# EAGLE design Skaarhoj BI8-1x8v1.1 (EAGLE 6.1)
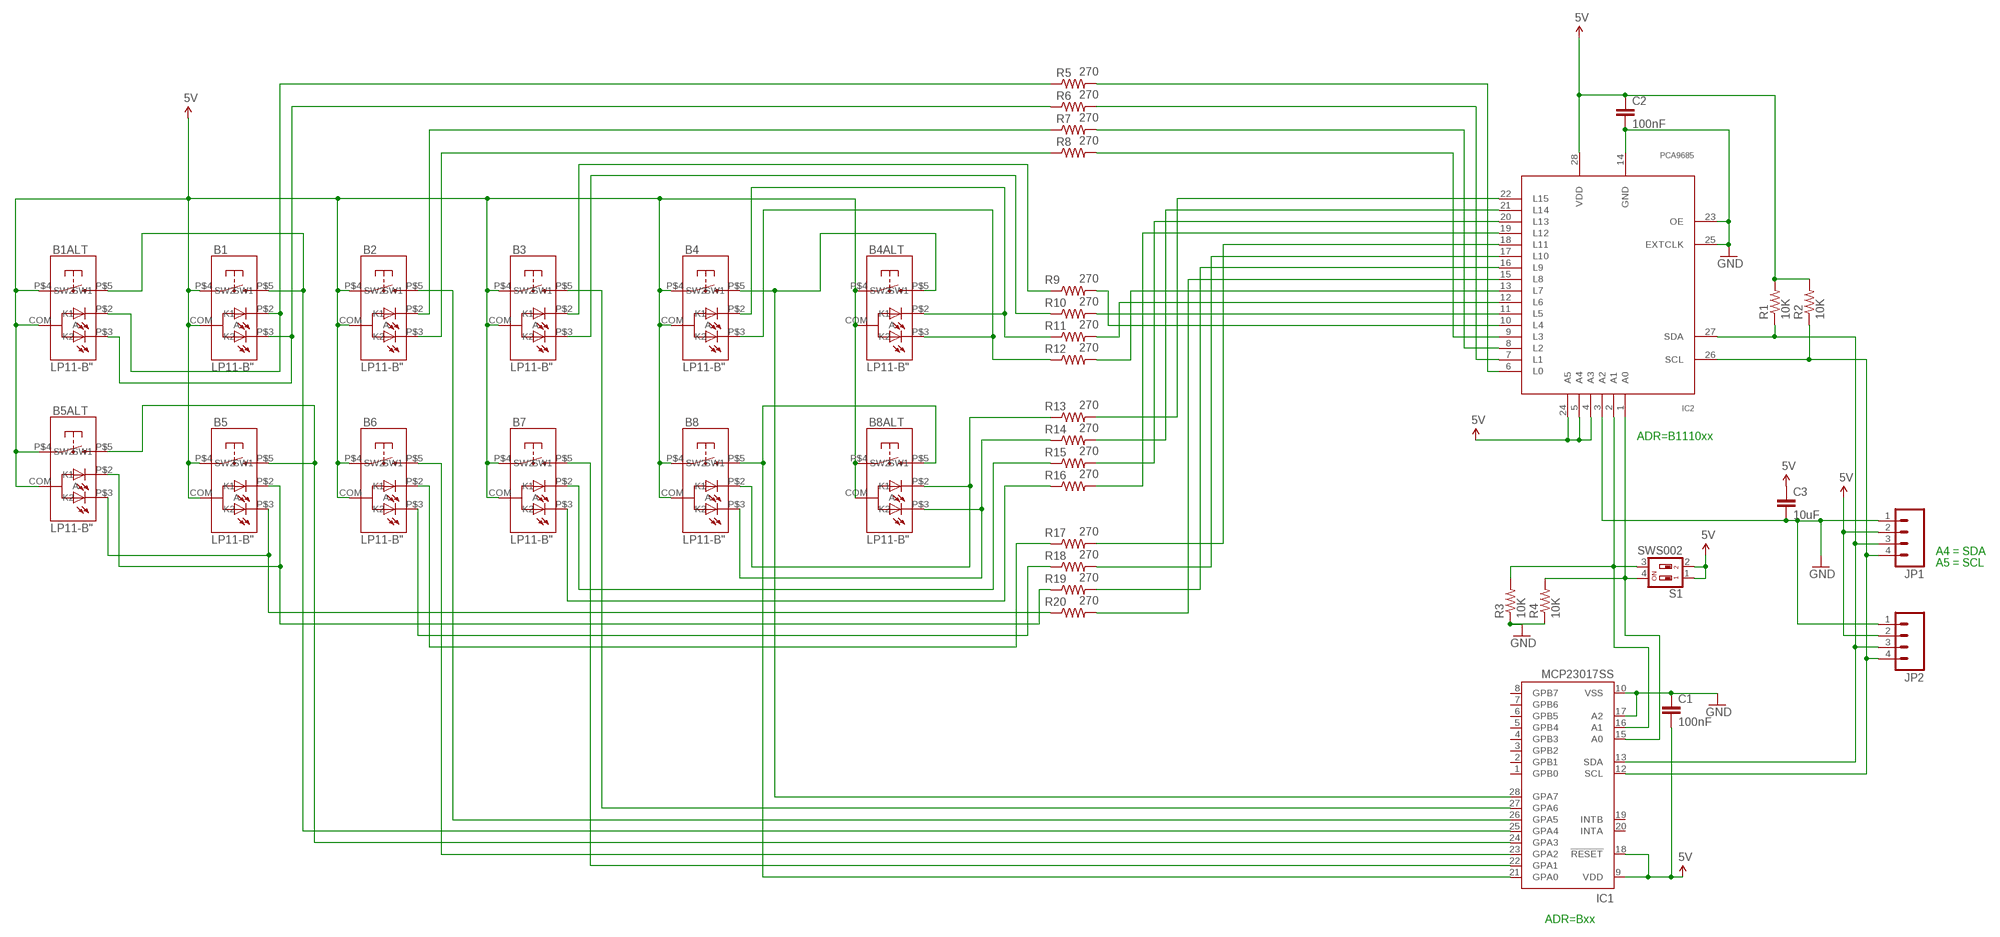
[diagram p0: schematic, sheet 1]

## Parts
B1  LP11-B"  [LP11]
B1ALT  LP11-B"  [LP11]
B2  LP11-B"  [LP11]
B3  LP11-B"  [LP11]
B4  LP11-B"  [LP11]
B4ALT  LP11-B"  [LP11]
B5  LP11-B"  [LP11]
B5ALT  LP11-B"  [LP11]
B6  LP11-B"  [LP11]
B7  LP11-B"  [LP11]
B8  LP11-B"  [LP11]
B8ALT  LP11-B"  [LP11]
C1  100nF  CAP0603-CAP  [0603-CAP]
C2  100nF  CAP0603-CAP  [0603-CAP]
C3  10uF  CAP0805  [0805]
IC1  MCP23017SS  [SSOP28]
IC2  PCA9685  [TSSOP28]
JP1  M04PTH  [1X04]
JP2  M04PTH  [1X04]
R1  10K  RESISTOR0603-RES  [0603-RES]
R2  10K  RESISTOR0603-RES  [0603-RES]
R3  10K  RESISTOR0603-RES  [0603-RES]
R4  10K  RESISTOR0603-RES  [0603-RES]
R5  270  RESISTOR0603-RES  [0603-RES]
R6  270  RESISTOR0603-RES  [0603-RES]
R7  270  RESISTOR0603-RES  [0603-RES]
R8  270  RESISTOR0603-RES  [0603-RES]
R9  270  RESISTOR0603-RES  [0603-RES]
R10  270  RESISTOR0603-RES  [0603-RES]
R11  270  RESISTOR0603-RES  [0603-RES]
R12  270  RESISTOR0603-RES  [0603-RES]
R13  270  RESISTOR0603-RES  [0603-RES]
R14  270  RESISTOR0603-RES  [0603-RES]
R15  270  RESISTOR0603-RES  [0603-RES]
R16  270  RESISTOR0603-RES  [0603-RES]
R17  270  RESISTOR0603-RES  [0603-RES]
R18  270  RESISTOR0603-RES  [0603-RES]
R19  270  RESISTOR0603-RES  [0603-RES]
R20  270  RESISTOR0603-RES  [0603-RES]
S1  SWS002  [SMS-002]

## Nets
5V [Power]: B1.COM(A) B1.P$4(SW1) B1ALT.COM(A) B1ALT.P$4(SW1) B2.COM(A) B2.P$4(SW1) B3.COM(A) B3.P$4(SW1) B4.COM(A) B4.P$4(SW1) B4ALT.COM(A) B4ALT.P$4(SW1) B5.COM(A) B5.P$4(SW1) B5ALT.COM(A) B5ALT.P$4(SW1) B6.COM(A) B6.P$4(SW1) B7.COM(A) B7.P$4(SW1) B8.COM(A) B8.P$4(SW1) B8ALT.COM(A) B8ALT.P$4(SW1) C1.2 C2.1 C3.1 IC1.9(VDD) IC1.18(!RESET) IC2.4(A3) IC2.5(A4) IC2.24(A5) IC2.28(VDD) JP1.2 JP2.2 R1.2 R2.2 S1.1 S1.2
GND [Power]: C1.1 C2.2 C3.2 IC1.10(VSS) IC1.17(A2) IC2.3(A2) IC2.14(GND) IC2.23(OE) IC2.25(EXTCLK) JP1.1 JP2.1 R3.1 R4.1
N$1: IC1.15(A0) IC2.1(A0) R4.2 S1.4
N$3: IC1.13(SDA) IC2.27(SDA) JP1.3 JP2.3 R1.1
N$4: B2.P$2(K1) R7.1
N$5: B2.P$3(K2) R8.1
N$6: IC1.12(SCL) IC2.26(SCL) JP1.4 JP2.4 R2.1
N$7: B1.P$2(K1) B1ALT.P$2(K1) R5.1
N$8: B1.P$3(K2) B1ALT.P$3(K2) R6.1
N$9: IC2.6(L0) R5.2
N$10: IC2.7(L1) R6.2
N$11: IC2.8(L2) R7.2
N$12: IC2.9(L3) R8.2
N$13: IC2.10(L4) R9.2
N$14: IC2.11(L5) R10.2
N$15: IC2.12(L6) R11.2
N$16: IC2.13(L7) R12.2
N$17: B3.P$2(K1) R9.1
N$18: B3.P$3(K2) R10.1
N$19: B4.P$2(K1) B4ALT.P$2(K1) R11.1
N$20: B4.P$3(K2) B4ALT.P$3(K2) R12.1
N$21: IC2.19(L12) R16.2
N$22: IC2.20(L13) R15.2
N$23: IC2.21(L14) R14.2
N$24: IC2.22(L15) R13.2
N$25: IC2.15(L8) R20.2
N$26: IC2.16(L9) R19.2
N$27: IC2.17(L10) R18.2
N$28: IC2.18(L11) R17.2
N$29: B5.P$3(K2) B5ALT.P$3(K2) R20.1
N$30: B5.P$2(K1) B5ALT.P$2(K1) R19.1
N$31: B6.P$3(K2) R18.1
N$32: B6.P$2(K1) R17.1
N$33: B7.P$3(K2) R16.1
N$34: B7.P$2(K1) R15.1
N$35: B8.P$3(K2) B8ALT.P$3(K2) R14.1
N$36: B8.P$2(K1) B8ALT.P$2(K1) R13.1
N$37: B1.P$5(SW2) B1ALT.P$5(SW2) IC1.25(GPA4)
N$38: B5.P$5(SW2) B5ALT.P$5(SW2) IC1.24(GPA3)
N$39: B6.P$5(SW2) IC1.23(GPA2)
N$40: B2.P$5(SW2) IC1.26(GPA5)
N$41: B8.P$5(SW2) B8ALT.P$5(SW2) IC1.21(GPA0)
N$42: B7.P$5(SW2) IC1.22(GPA1)
N$43: B4.P$5(SW2) B4ALT.P$5(SW2) IC1.28(GPA7)
N$44: B3.P$5(SW2) IC1.27(GPA6)
N$47: IC1.16(A1) IC2.2(A1) R3.2 S1.3
Unconnected: IC1.1(GPB0) IC1.2(GPB1) IC1.3(GPB2) IC1.4(GPB3) IC1.5(GPB4) IC1.6(GPB5) IC1.7(GPB6) IC1.8(GPB7) IC1.19(INTB) IC1.20(INTA)

## Notes on the sheet
- ADR=B1110xx
- A4 = SDA
- A5 = SCL
- ADR=Bxx

## Library data of the parts
B1 B1ALT B2-B4 B4ALT B5 B5ALT B6-B8 B8ALT = SKAARHOJ:LP11-B
C1-C3 = SparkFun:CAP: Capacitor Standard 0603 ceramic capacitor, and 0.1" leaded capacitor.
IC1 = microchip:MCP23017: http://ww1.microchip.com/downloads/en/DeviceDoc/21952a.pdf Source: http://ww1.microchip.com/downloads/en/DeviceDoc/21952a.pdf; MF: MICROCHIP; MPN: MCP23017-E/SS; OC_FARNELL: 1467674; OC_NEWARK: 31K2960
IC2 = wsmith:PCA9685
JP1 JP2 = SparkFun:M04: Header 4 Standard 4-pin 0.1" header. Use with straight break away headers (SKU : PRT-00116), right angle break away headers (PRT-00553), swiss pins (PRT-00743), machine pins (PRT-00117), and female headers (PRT-00115). Molex polarized connector foot print use with SKU : PRT-08231 with associated crimp pins and housings. 1MM SMD Version SKU: PRT-10208
R1-R20 = SparkFun:RESISTOR: Resistor Basic schematic elements and footprints for 0603, 1206, and PTH resistors.
S1 = smd-special:SWS002: SMD Dip Switch 2 pol.

## Board
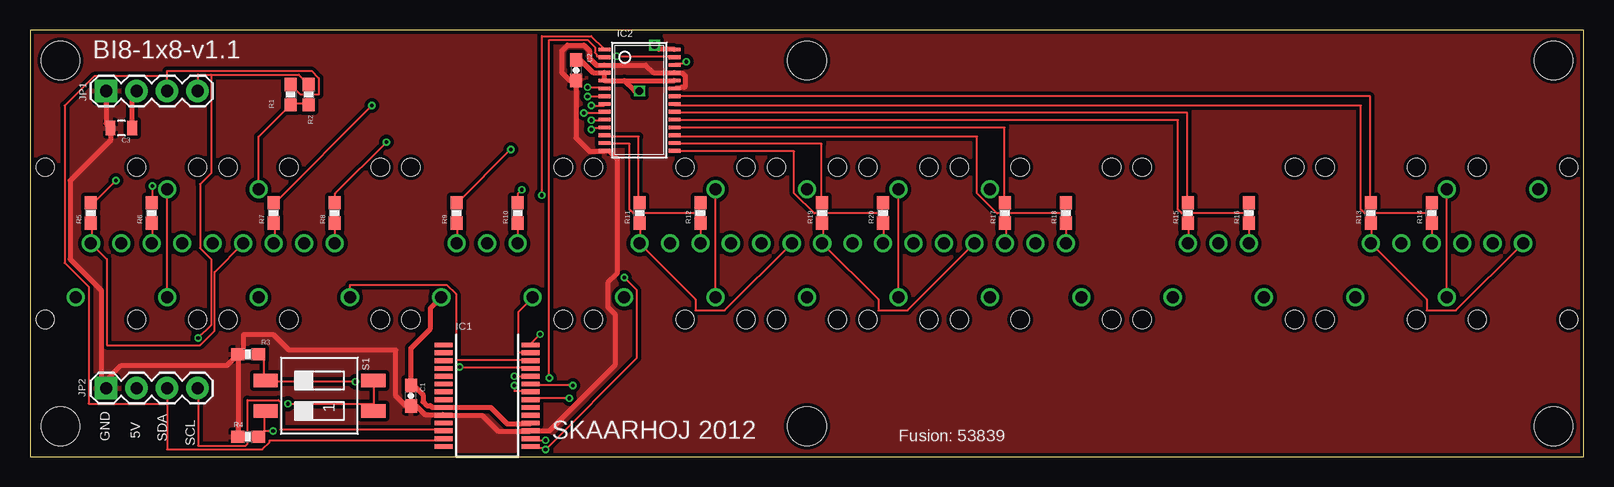
[diagram p1: board, top side]
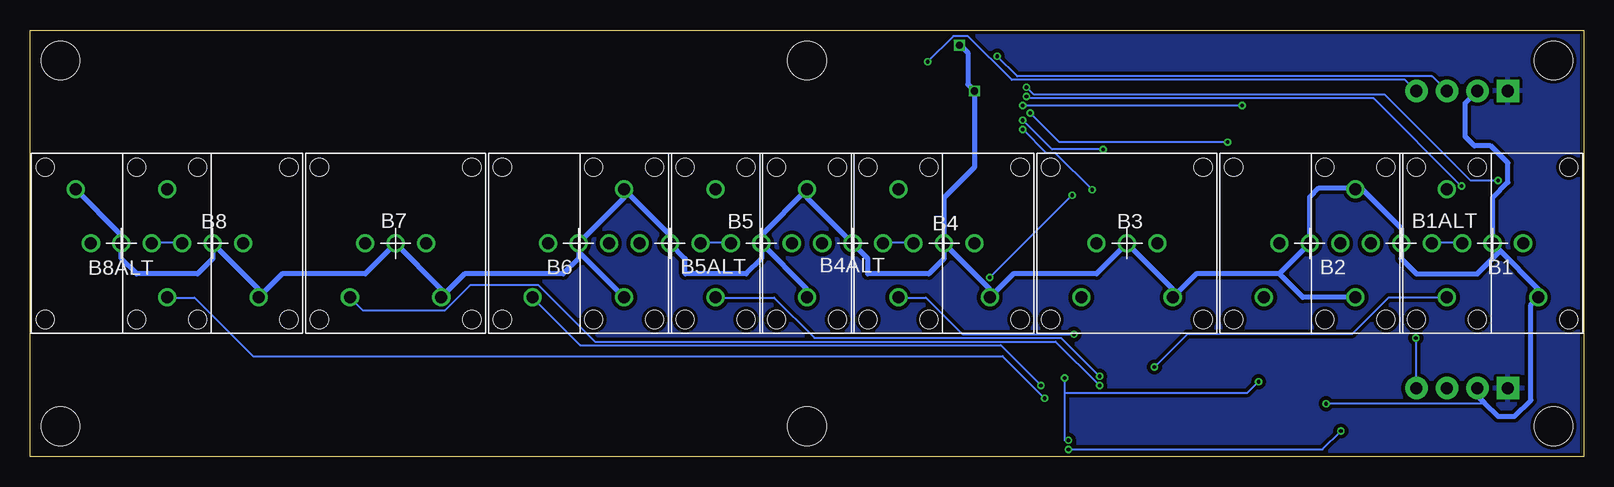
[diagram p2: board, bottom side, seen from below]

Size 129.54 x 35.56 mm. Coordinates in mm from the lower left corner, seen from the top.
Outline: 0,0 129.54,0 129.54,35.56 0,35.56 0,0
Copper layers (1*16): Top 0.035mm / dielectric 1.5mm / Bottom 0.035mm
Design rules: minimum track width 6mil, minimum drill 12mil, track to track 6mil, track to pad 6mil, pad to pad 6mil, via to via 6mil, smd to smd 0mil, copper to edge 10mil, drill to drill 10mil, minimum pad ring 10mil, minimum via ring 6mil, stop-mask expansion 2mil, vias tented up to drill 100mil, thermal gap 10mil
Holes 3.2 mm at 2.54,33.02 2.54,2.54 127,2.54 127,33.02 64.77,33.02 64.77,2.54

### Footprints (pad centres in the part's own frame; a part is rotated, then mirrored left to right if it is on the bottom)
LP11 = drill 1: COM 0,0; P$2 0,2.54; P$3 0,-2.54; P$4 4.5,3.81; P$5 4.5,-3.81 | hole 1.5: -6.35,6.35; 6.35,6.35; 6.35,-6.35; -6.35,-6.35
0603-CAP = smd 1.1 x 1: 1 -0.85,0; 2 0.85,0
0805 = smd 0.8 x 1.2: 1 -0.9,0; 2 0.9,0
SSOP28 = smd 0.4 x 1.5: 1 -4.225,-3.625; 2 -3.575,-3.625; 3 -2.925,-3.625; 4 -2.275,-3.625; 5 -1.625,-3.625; 6 -0.975,-3.625; 7 -0.325,-3.625; 8 0.325,-3.625; 9 0.975,-3.625; 10 1.625,-3.625; 11 2.275,-3.625; 12 2.925,-3.625; 13 3.575,-3.625; 14 4.225,-3.625; 15 4.225,3.625; 16 3.575,3.625; 17 2.925,3.625; 18 2.275,3.625; 19 1.625,3.625; 20 0.975,3.625; 21 0.325,3.625; 22 -0.325,3.625; 23 -0.975,3.625; 24 -1.625,3.625; 25 -2.275,3.625; 26 -2.925,3.625; 27 -3.575,3.625; 28 -4.225,3.625
TSSOP28 = smd 0.305 x 0.991: 1 -4.225,-2.918; 2 -3.575,-2.918; 3 -2.925,-2.918; 4 -2.275,-2.918; 5 -1.625,-2.918; 6 -0.975,-2.918; 7 -0.325,-2.918; 8 0.325,-2.918; 9 0.975,-2.918; 10 1.625,-2.918; 11 2.275,-2.918; 12 2.925,-2.918; 13 3.575,-2.918; 14 4.225,-2.918; 15 4.225,2.918; 16 3.575,2.918; 17 2.925,2.918; 18 2.275,2.918; 19 1.625,2.918; 20 0.975,2.918; 21 0.325,2.918; 22 -0.325,2.918; 23 -0.975,2.918; 24 -1.625,2.918; 25 -2.275,2.918; 26 -2.925,2.918; 27 -3.575,2.918; 28 -4.225,2.918
1X04 = drill 1.016 pad 1.88 square: 1 0,0 | drill 1.016 pad 1.88: 2 2.54,0; 3 5.08,0; 4 7.62,0
0603-RES = smd 1.1 x 1: 1 -0.85,0; 2 0.85,0
SMS-002 = smd 1.092 x 2.007: 1 -1.27,-4.496; 2 1.27,-4.496; 3 1.27,4.496; 4 -1.27,4.496

### Placement (x,y rotation side)
B1  7.62,17.78 270 bottom
B1ALT  15.24,17.78 90 bottom
B2  22.86,17.78 270 bottom
B3  38.1,17.78 270 bottom
B4  53.34,17.78 270 bottom
B4ALT  60.96,17.78 90 bottom
B5  68.58,17.78 270 bottom
B5ALT  76.2,17.78 90 bottom
B6  83.82,17.78 270 bottom
B7  99.06,17.78 270 bottom
B8  114.3,17.78 270 bottom
B8ALT  121.92,17.78 90 bottom
C1  31.75,5.08 90 top
C2  45.52,32.21 270 top
C3  7.62,27.38 180 top
IC1  38.1,5.08 270 top
IC2  50.8,29.72 270 top
JP1  6.35,30.48 0 top
JP2  6.35,5.71 0 top
R1  21.74,30.18 270 top
R2  23.22,30.18 270 top
R3  18.19,8.53 0 top
R4  18.19,1.68 0 top
R5  5.08,20.32 90 top
R6  10.16,20.32 90 top
R7  20.32,20.32 90 top
R8  25.4,20.32 90 top
R9  35.56,20.32 90 top
R10  40.64,20.32 90 top
R11  50.8,20.32 90 top
R12  55.88,20.32 90 top
R13  111.76,20.32 90 top
R14  116.84,20.32 90 top
R15  96.52,20.32 90 top
R16  101.6,20.32 90 top
R17  81.28,20.32 90 top
R18  86.36,20.32 90 top
R19  66.04,20.32 90 top
R20  71.12,20.32 90 top
S1  24.13,5.08 90 top

### Tracks (layer width: path | path; a pad name or v marks a point on that pad's centre or on a via)
5V  (via drill 0.3, 0.6)
  Top 0.152: 28.65,4.42 28.65,6.25 S1.2 | 28.65,4.42 28.65,3.81 S1.1 | R2.2 23.16,29.41 21.79,29.41 R1.2 21.64,29.26 19.05,26.67 B1ALT.P$4 | v21.49,4.42 28.65,4.42
  Top 0.406: C3.1 8.52,30.11 JP1.2 | C2.1 45.89,33.06 46.94,32 47.87,32 IC2.4 IC2.5 49.53,31.34 | 49.53,31.34 IC2.24 | IC1.18 41.66,2.74 39.78,2.74 38.41,4.11 IC1.9 34.47,4.12 33.53,4.12 33.38,4.27 33.07,4.27 32.77,4.57 32.77,5.18 32.02,5.93 C1.2 31.75,9.04 33.38,10.67 33.38,12.37 B3.P$4 | IC2.28 52.42,33.94 v52.07,34.29 | v50.8,30.48 50.39,30.48 49.53,31.34
  Bottom 0.152: v21.49,4.42 8.38,4.42 8.31,4.5
  Bottom 0.406: JP2.2 8.89,5.08 8.31,4.5 7.16,3.35 5.79,3.35 4.42,4.72 4.42,12.67 B1.P$4 3.81,13.97 6.99,17.14 | 6.99,17.14 B1.COM 7.62,21.59 6.35,22.86 6.35,24.49 7.77,25.91 9.14,25.91 9.91,26.67 9.91,29.46 JP1.2 | v52.07,34.29 51.97,34.29 51.36,33.68 51.36,31.04 v50.8,30.48 50.8,24.13 53.34,21.59 B4.COM | B4.COM 49.53,13.97 B4.P$4 47.57,15.24 40.64,15.24 B3.COM 34.29,13.97 B3.P$4 32.33,15.24 25.4,15.24 | B5.P$4 64.77,13.97 B5.COM | B5.COM 68.58,18.47 B4ALT.P$4 64.77,21.59 B4ALT.COM 59.69,16.51 59.69,15.24 54.61,15.24 53.34,16.51 B4.COM | B6.COM 80.01,21.59 B5ALT.P$4 76.2,18.47 B5ALT.COM 74.93,16.51 74.93,15.24 69.85,15.24 68.58,16.51 B5.COM | B6.COM 83.82,17.09 B6.P$4 | B6.COM 83.82,16.51 85.09,15.24 93.29,15.24 B7.P$4 95.25,13.97 B7.COM 101.6,15.24 108.53,15.24 B8.P$4 110.49,13.97 B8.COM 114.3,16.51 115.57,15.24 120.65,15.24 121.92,16.51 B8ALT.COM 121.92,18.47 B8ALT.P$4 | B2.P$4 23.44,13.28 25.4,15.24 | 25.4,15.24 B2.COM 22.86,21.64 22.1,22.4 19.17,22.4 B1ALT.P$4 18.47,22.28 15.24,19.05 B1ALT.COM 15.24,16.51 13.97,15.24 8.89,15.24 6.99,17.14
GND
  Top 0.254: 54.25,30.79 53.81,30.79 IC2.23
  Top 0.406: JP1.1 6.35,27.75 C3.2 6.72,26.38 3.35,23.01 3.35,16.46 5.94,13.87 5.94,6.12 JP2.1 6.35,6.35 7.62,7.62 16.42,7.62 R3.1 | R3.1 R4.1 | R3.1 17.78,8.98 17.78,10.16 20.32,10.16 21.59,8.89 30.48,8.89 30.48,5.08 31.33,4.23 C1.1 32.19,4.23 32.92,3.5 34.42,3.5 IC1.10 37.69,3.46 39.01,2.13 41.7,2.13 IC1.17 41.75,2.13 43.28,2.13 48.77,7.62 48.77,11.89 48.16,12.5 48.16,14.48 48.92,15.24 48.92,24.84 48.27,25.49 IC2.14 47.84,25.45 46.63,25.45 45.52,26.57 C2.2 44.99,31.36 44.35,32 44.35,33.83 44.81,34.29 46.18,34.29 46.63,33.83 46.63,33.22 47.24,32.61 47.85,32.61 IC2.3 51.33,32.64 51.97,32 53.71,32 IC2.25 54.37,31.99 54.61,31.75 54.61,30.84 54.56,30.79 54.25,30.79
  pour Bottom (isolate 0.305): 0,35.56 129.54,35.56 129.54,0 0,0
  pour Top (isolate 0.305): 0,35.56 129.54,35.56 129.54,0 0,0
N$1  (via drill 0.3)
  Top 0.152: 19.51,2.13 R4.2 19.51,2.13 | 19.51,2.13 19.51,3.81 S1.4 | v42.67,21.79 42.67,35.05 46.79,35.05 47.85,33.98 IC2.1 | v49.53,14.94 50.6,13.87 50.6,8.23 43.13,0.76 42.98,0.76 | 42.98,0.76 41.76,0.76 IC1.15 | v20.27,2.13 19.51,2.13 | 42.98,0.76 v42.98,0.61
  Bottom 0.152: v49.53,14.94 v42.67,21.79 | v20.27,2.13 21.79,0.61 v42.98,0.61
N$3  (via drill 0.3)
  Top 0.152: JP2.3 11.43,4.42 | 11.43,4.42 11.43,0.61 19.36,0.61 19.96,1.22 19.96,1.37 34.44,1.37 IC1.13 | v48.92,33.38 53.65,33.38 IC2.27 | JP1.3 11.43,31.7 | 11.43,31.7 11.43,32.16 23.47,32.16 24.08,31.55 24.08,30.18 22.55,30.18 21.79,30.94 R1.1 | 11.43,4.42 4.88,4.42 4.88,14.17 2.9,16.15 2.9,29.26 5.33,31.7 11.43,31.7
  Bottom 0.152: v48.92,33.38 47.24,31.7 12.65,31.7 JP1.3
N$4
  Top 0.152: R7.1 20.42,19.36 20.42,17.83 B2.P$2
N$5
  Top 0.152: R8.1 25.45,19.36 25.45,17.83 B2.P$3
N$6  (via drill 0.3)
  Top 0.152: IC1.12 34.44,2.29 20.88,2.29 20.88,4.57 20.73,4.72 18.14,4.72 18.14,1.07 17.98,0.91 14.02,0.91 14.02,5.64 JP2.4 | v54.71,32.92 54.71,32.77 53.8,32.77 IC2.26 | 15.09,31.85 14.02,31.85 14.02,30.48 JP1.4 | 15.09,31.85 22.4,31.85 23.16,31.09 R2.1 | v14.02,9.91 15.09,10.97 15.09,16.46 14.17,17.37 14.17,22.71 15.09,23.62 15.09,31.85
  Bottom 0.152: v54.71,32.92 52.58,35.05 51.36,35.05 47.7,31.39 14.94,31.39 14.02,30.48 JP1.4 | v14.02,9.91 14.02,5.79 JP2.4
N$7
  Top 0.152: R5.1 5.18,19.36 5.18,17.83 B1.P$2 6.4,16.46 6.4,9.3 14.17,9.3 15.39,10.52 15.39,15.39 B1ALT.P$2
N$8
  Top 0.152: R6.1 10.21,19.36 10.21,17.83 B1.P$3
  Bottom 0.152: B1ALT.P$3 12.65,17.83 10.21,17.83 B1.P$3
N$9  (via drill 0.3)
  Top 0.152: v46.48,30.79 47.85,30.79 IC2.6 | v7.16,23.01 5.18,21.03 R5.2
  Bottom 0.152: v46.48,30.79 45.87,30.18 16.61,30.18 9.45,23.01 v7.16,23.01
N$10  (via drill 0.3)
  Top 0.152: v46.48,30.02 47.85,30.02 IC2.7 | v10.21,22.55 10.21,21.18 R6.2
  Bottom 0.152: v46.48,30.02 46.33,29.87 17.53,29.87 v10.21,22.55
N$11  (via drill 0.3)
  Top 0.152: v46.79,29.26 47.85,29.26 IC2.8 | v28.5,29.26 20.42,21.18 R7.2
  Bottom 0.152: v28.5,29.26 v46.79,29.26
N$12  (via drill 0.3)
  Top 0.152: v46.18,28.65 47.85,28.65 IC2.9 | v29.72,26.21 25.45,21.95 25.45,21.18 R8.2
  Bottom 0.152: v46.18,28.65 43.74,26.21 v29.72,26.21
N$13  (via drill 0.3)
  Top 0.152: v46.79,28.04 47.85,28.04 IC2.10 | v40.08,25.6 35.66,21.18 R9.2
  Bottom 0.152: v46.79,28.04 44.35,25.6 v40.08,25.6
N$14  (via drill 0.3)
  Top 0.152: v46.79,27.28 46.79,27.43 47.85,27.43 IC2.11 | v41,22.25 40.69,21.95 40.69,21.18 R10.2
  Bottom 0.152: v46.79,27.28 44.81,25.3 44.04,25.3 v41,22.25
N$15
  Top 0.152: IC2.12 48.01,26.67 50.75,26.67 50.75,21.18 R11.2
N$16
  Top 0.152: IC2.13 48.01,26.06 49.99,26.06 49.99,20.57 50.29,20.27 55.78,20.27 55.78,21.03 R12.2
N$17
  Top 0.152: R9.1 35.66,19.36 35.66,17.83 B3.P$2
N$18
  Top 0.152: R10.1 40.69,19.36 40.69,17.83 B3.P$3
N$19
  Top 0.152: R11.1 50.9,19.36 50.9,17.83 B4.P$2 55.47,13.11 55.47,12.19 57.91,12.19 B4ALT.P$2
N$20
  Top 0.152: R12.1 55.93,19.36 55.93,17.83 B4.P$3
  Bottom 0.152: B4ALT.P$3 58.37,17.83 55.93,17.83 B4.P$3
N$21
  Top 0.152: IC2.19 53.8,28.04 95.71,28.04 95.71,20.57 96.01,20.27 101.5,20.27 101.5,21.03 R16.2
N$22
  Top 0.152: IC2.20 53.8,28.65 96.47,28.65 96.47,21.18 R15.2
N$23
  Top 0.152: IC2.21 53.8,29.26 110.95,29.26 110.95,20.57 111.25,20.27 116.74,20.27 116.74,21.03 R14.2
N$24
  Top 0.152: IC2.22 53.8,30.02 111.71,30.02 111.71,21.18 R13.2
N$25
  Top 0.152: IC2.15 53.8,25.45 63.7,25.45 63.7,21.95 65.38,20.27 71.02,20.27 71.02,21.03 R20.2
N$26
  Top 0.152: IC2.16 53.8,26.06 65.99,26.06 65.99,21.18 R19.2
N$27
  Top 0.152: IC2.17 53.8,26.67 78.94,26.67 78.94,21.95 80.62,20.27 86.26,20.27 86.26,21.03 R18.2
N$28
  Top 0.152: IC2.18 53.8,27.43 81.23,27.43 81.23,21.18 R17.2
N$29
  Top 0.152: R20.1 71.17,19.36 71.17,17.83 B5.P$3
  Bottom 0.152: B5ALT.P$3 73.61,17.83 71.17,17.83 B5.P$3
N$30
  Top 0.152: R19.1 66.14,19.36 66.14,17.83 B5.P$2 70.71,13.11 70.71,12.19 73.15,12.19 B5ALT.P$2
N$31
  Top 0.152: R18.1 86.41,19.36 86.41,17.83 B6.P$3
N$32
  Top 0.152: R17.1 81.38,19.36 81.38,17.83 B6.P$2
N$33
  Top 0.152: R16.1 101.65,19.36 101.65,17.83 B7.P$3
N$34
  Top 0.152: R15.1 96.62,19.36 96.62,17.83 B7.P$2
N$35
  Top 0.152: R14.1 116.89,19.36 116.89,17.83 B8.P$3
  Bottom 0.152: B8ALT.P$3 119.33,17.83 116.89,17.83 B8.P$3
N$36
  Top 0.152: R13.1 111.86,19.36 111.86,17.83 B8.P$2 116.43,13.11 116.43,12.19 118.87,12.19 B8ALT.P$2
N$37  (via drill 0.3)
  Top 0.152: v35.81,7.47 41.6,7.47 IC1.25 | B1.P$5 B1ALT.P$5
  Bottom 0.152: v35.81,7.47 33.07,10.21 19.36,10.21 16.31,13.26 11.43,13.26 B1.P$5
N$38  (via drill 0.3)
  Top 0.152: v40.39,6.71 41.6,6.71 IC1.24 | B5.P$5 B5ALT.P$5
  Bottom 0.152: v40.39,6.71 43.59,9.91 64.16,9.91 67.51,13.26 72.39,13.26 B5.P$5
N$39  (via drill 0.3)
  Top 0.152: v45.26,5.94 41.76,5.94 IC1.23
  Bottom 0.152: v45.26,5.94 48.62,9.3 83.67,9.3 87.63,13.26 B6.P$5
N$40
  Top 0.152: B2.P$5 26.67,14.33 34.75,14.33 35.51,13.56 35.51,8.08 41.6,8.08 IC1.26
N$41  (via drill 0.3)
  Top 0.152: v44.96,4.88 41.76,4.88 IC1.21 | B8.P$5 B8ALT.P$5
  Bottom 0.152: v44.96,4.88 48.46,8.38 110.95,8.38 115.82,13.26 118.11,13.26 B8.P$5
N$42  (via drill 0.3)
  Top 0.152: v40.39,5.94 40.39,5.49 41.6,5.49 IC1.22
  Bottom 0.152: v40.39,5.94 44.04,9.6 82.45,9.6 87.17,14.33 92.81,14.33 94.94,12.19 101.8,12.19 102.87,13.26 B7.P$5
N$43  (via drill 0.3)
  Top 0.152: v42.52,10.21 41.76,9.45 IC1.28 | B4.P$5 B4ALT.P$5
  Bottom 0.152: v42.52,10.21 51.82,10.21 54.86,13.26 57.15,13.26 B4.P$5
N$44
  Top 0.152: IC1.27 41.6,8.69 40.69,8.69 40.69,12.04 41.91,13.26 B3.P$5
N$47  (via drill 0.3)
  Top 0.152: R3.2 19.51,8.08 19.51,6.4 S1.3 19.66,6.25 v27.13,6.25 | v43.28,6.55 43.28,34.75 46.48,34.75 47.09,34.14 47.09,33.68 47.24,33.53 47.24,33.38 47.85,33.38 IC2.2 | v42.98,1.37 41.76,1.37 IC1.16
  Bottom 0.152: 43.28,5.33 43.28,1.37 v42.98,1.37 | 43.28,5.33 v43.28,6.55 | v27.13,6.25 28.04,5.33 43.28,5.33

### Text on the board
_tsilk: BI8-1x8-v1.1 | 5V | GND | SDA | SCL | SKAARHOJ 2012 | Fusion: 53839